# Altium schematic sheet POWER.SchDoc
size 420 x 297 mm; DocumentNumber: 4; SheetNumber: 4; SheetTotal: 17
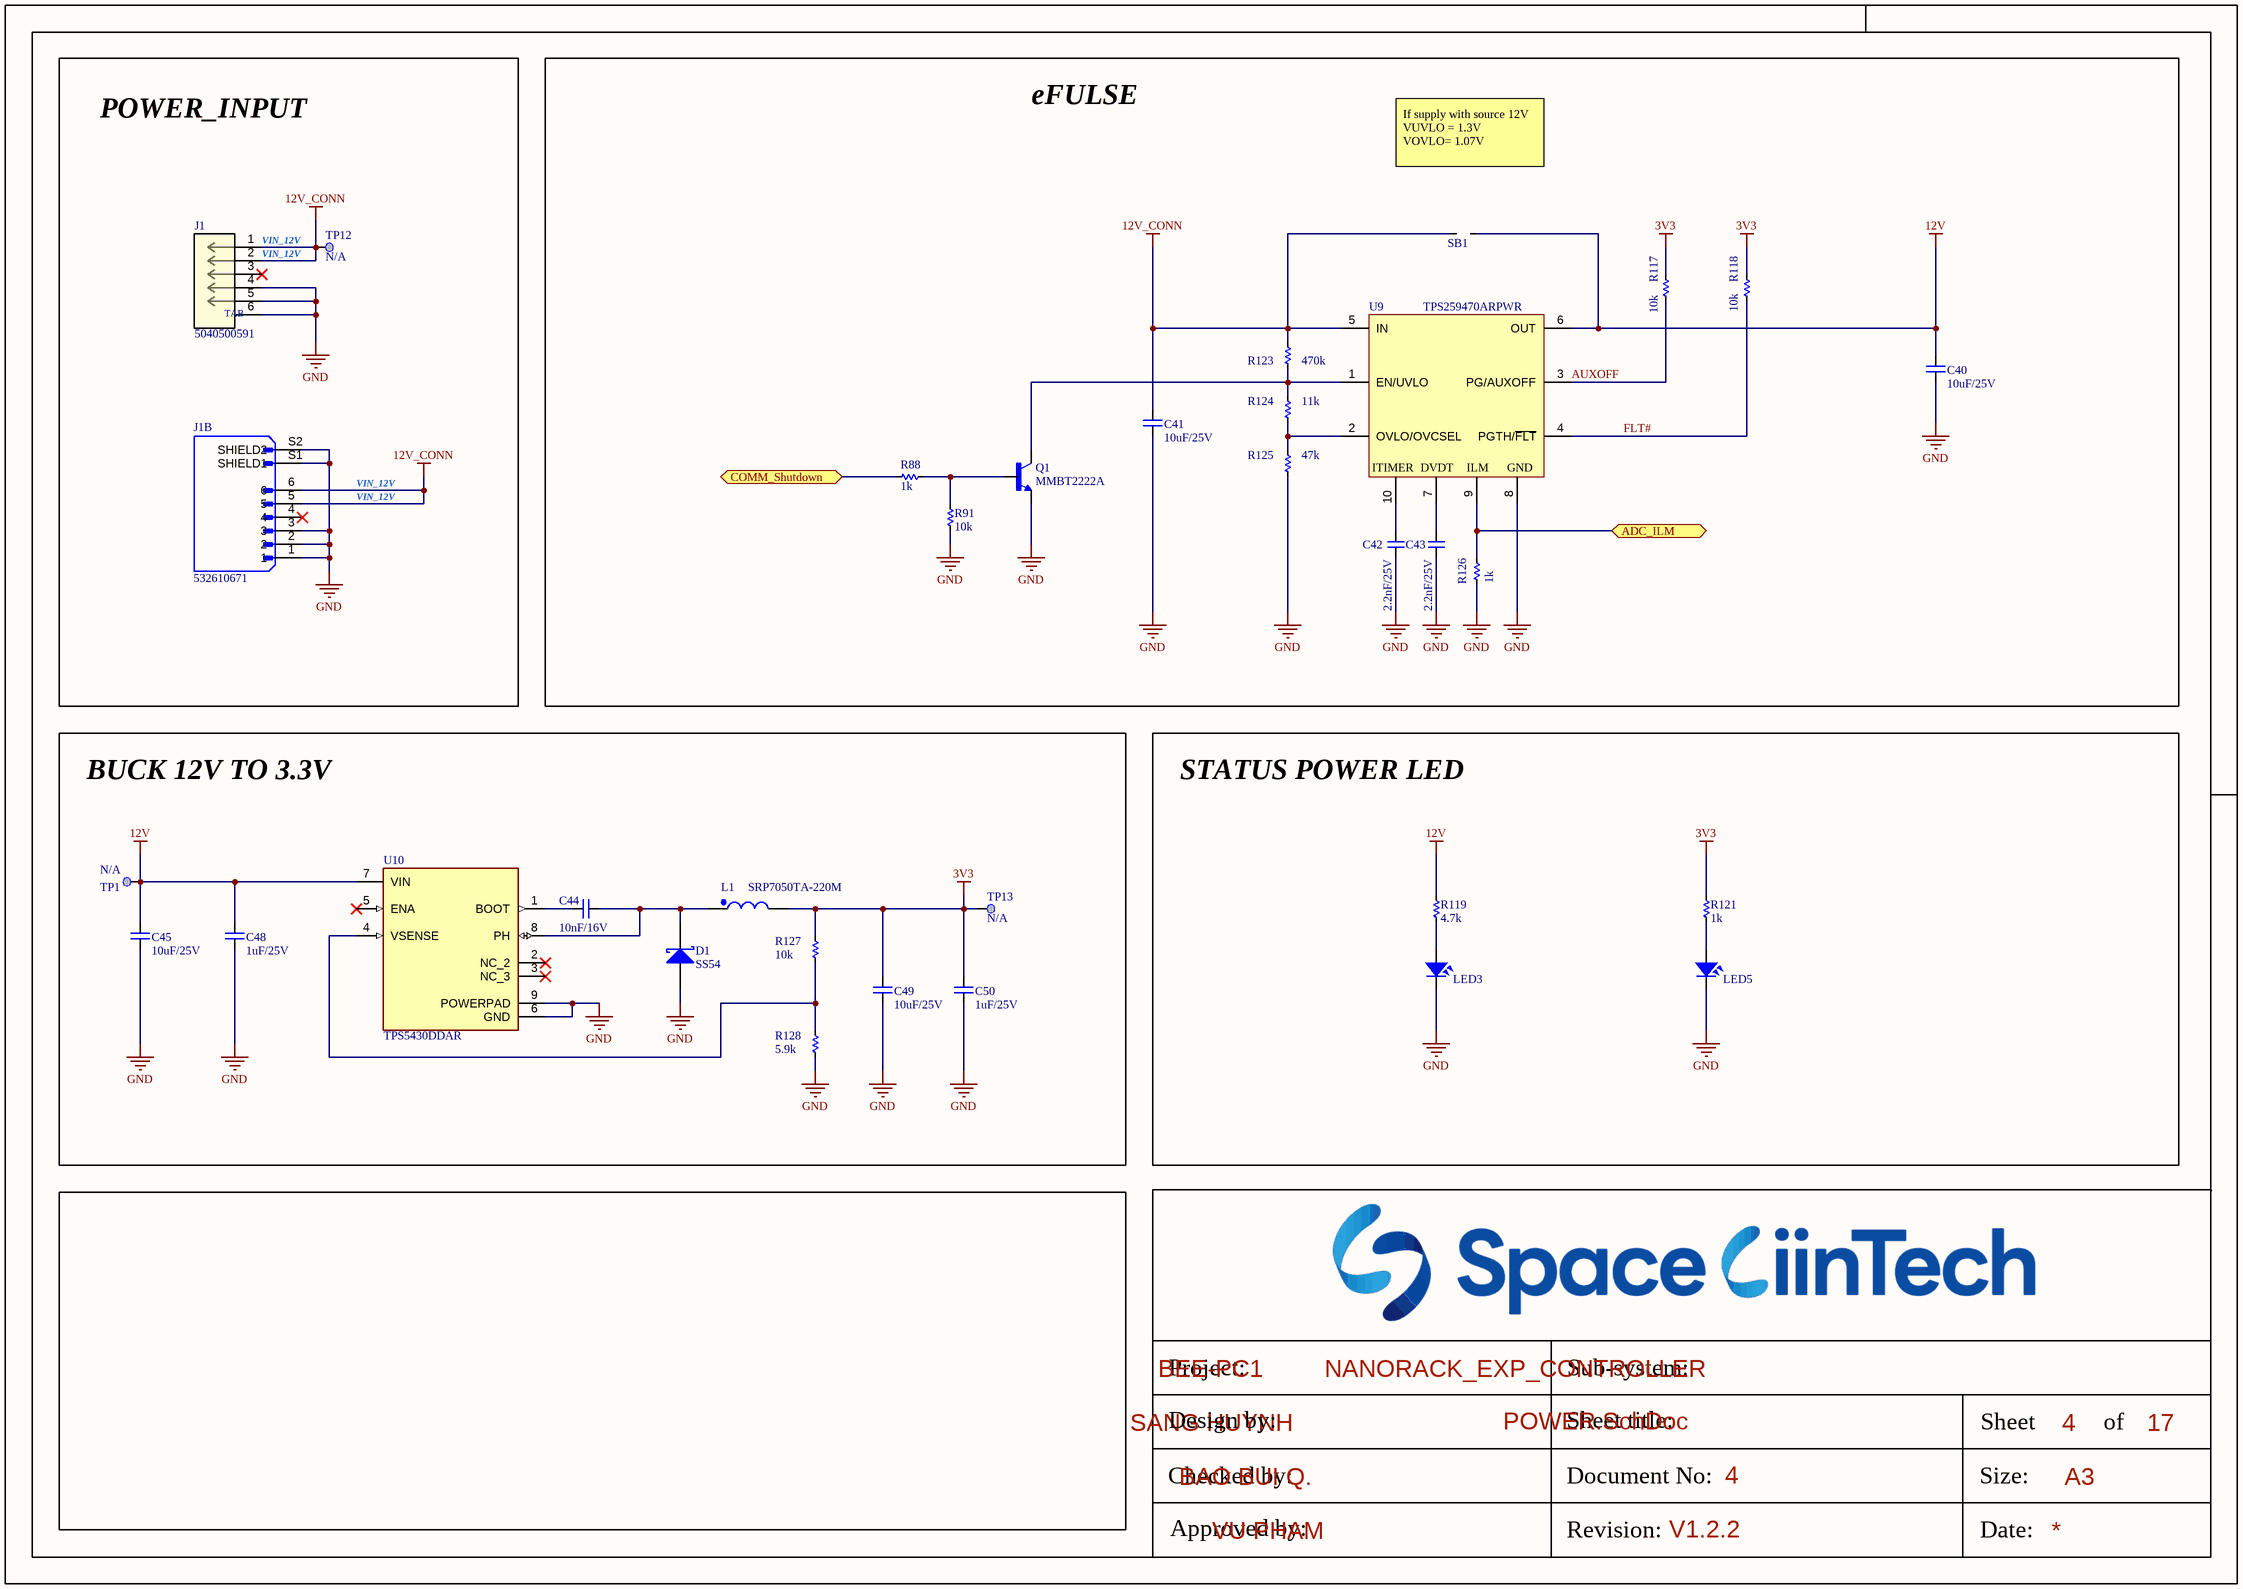
[diagram p0: POWER.SchDoc]

## Parts
C40  10uF/25V  [CAP_C_1608X80]
C41  10uF/25V  [CAP_C_1608X80]
C42  2.2nF/25V  [CAP_C_1608X80]
C43  2.2nF/25V  [CAP_C_1608X80]
C44  10nF/16V  [CAP_C_1608X80]
C45  10uF/25V  [CAP_C_1608X80]
C48  1uF/25V  [CAP_C_1608X80]
C49  10uF/25V  [CAP_C_1608X80]
C50  1uF/25V  [CAP_C_1608X80]
D1  SS54  [DO-214AC_SMA]
J1  5040500591  [5040500591]
J1B  532610671  [MOLEX_532610671]
L1  SRP7050TA-220M  [SRP7050TA-220M]
LED3  150060RS75000  [LED_0603]  (value not drawn)
LED5  150060YS75000  [LED_0603]  (value not drawn)
Q1  MMBT2222A  [SOT95P240X120-3N]
R88  1k  [RES_C_1608X60]
R91  10k  [RES_C_1608X60]
R117  10k  [RES_C_1608X60]
R118  10k  [RES_C_1608X60]
R119  4.7k  [RES_C_1608X60]
R121  1k  [RES_C_1608X60]
R123  470k  [RES_C_1608X60]
R124  11k  [RES_C_1608X60]
R125  47k  [RES_C_1608X60]
R126  1k  [RES_C_1608X60]
R127  10k  [RES_C_1608X60]
R128  5.9k  [RES_C_1608X60]
SB1  JUMPER  [JUMPER_1608]  (value not drawn)
TP1  Test Point  [TESTPOINT]  (value not drawn)  (no BOM)
TP12  Test Point  [TESTPOINT]  (value not drawn)  (no BOM)
TP13  Test Point  [TESTPOINT]  (value not drawn)  (no BOM)
U9  TPS259470ARPWR  [VQFN-HR-10]
U10  TPS5430DDAR  [CONV_TPS5430DDAR]

## Blocks framed on the sheet
POWER_INPUT: J1 J1B TP12
eFULSE: C40-C43 Q1 R88 R91 R117 R118 R123-R126 SB1 U9
BUCK 12V TO 3.3V: C44 C45 C48-C50 D1 L1 R127 R128 TP1 TP13 U10
STATUS POWER LED: LED3 LED5 R119 R121

## Ports
ADC_ILM (bidir), COMM_Shutdown (bidir)

## Nets
3V3: C49.2 C50.2 L1.2 R117.2 R118.2 R121.2 R127.1 TP13.1
12V: C40.2 C45.2 C48.2 R119.2 SB1.2 TP1.1 U9.6(OUT) U10.7(VIN)
12V_CONN: C41.2 J1.1 J1.2 J1B.5 J1B.6 R123.1 SB1.1 TP12.1 U9.5(IN)
GND: C40.1 C41.1 C42.1 C43.1 C45.1 C48.1 C49.1 C50.1 D1.1(A) J1.4 J1.5 J1.6 J1B.1 J1B.2 J1B.3 J1B.S1(SHIELD1) J1B.S2(SHIELD2) LED3.2 LED5.2 Q1.2(E) R91.1 R125.2 R126.2 R128.2 U9.8(GND) U10.6(GND) U10.9(POWERPAD)
ADC_ILM: R126.1 U9.9(ILM) ; port ADC_ILM
AUXOFF: R117.1 U9.3(PG/AUXOFF)
COMM_Shutdown: R88.1 ; port COMM_Shutdown
FLT#: R118.1 U9.4(PGTH/~{FLT})
NetC42_2: C42.2 U9.10(ITIMER)
NetC43_2: C43.2 U9.7(DVDT)
NetC44_1: C44.1 D1.2(K) L1.1 U10.8(PH)
NetC44_2: C44.2 U10.1(BOOT)
NetLED3_1: LED3.1 R119.1
NetLED5_1: LED5.1 R121.1
NetQ1_1: Q1.1(B) R88.2 R91.2
NetQ1_3: Q1.3(C) R123.2 R124.1 U9.1(EN/UVLO)
NetR124_2: R124.2 R125.1 U9.2(OVLO/OVCSEL)
NetR127_2: R127.2 R128.1 U10.4(VSENSE)

Not connected (* = marked no-connect by the designer): J1 3*; J1B 4*; U10 2(NC_2)* 3(NC_3)* 5(ENA)*

## Notes on the sheet
- If supply with source 12V
  VUVLO = 1.3V
  VOVLO= 1.07V
- VIN_12V
- Project:
- BEE-PC1
- Sub-system:
- NANORACK_EXP_CONTROLLER
- Design by:
- SANG HUYNH
- BAO BUI Q.
- Sheet title:
- Sheet
- A3
- of
- Checked by:
- Approved by:
- VU PHAM
- Revision:
- Document No:
- V1.2.2
- Size:
- Date:
- (in symbol 5040500591) TAB

## Library data of the parts
C40 C41 C44 C45 C48-C50 = CAP_SMD: CAP_Chip; Value: 33pF
C42 C43 = _CAP_C_2: CAP CHIP
D1 = SS54: DIODE SCHOTTKY 40V 5A SMA; MPN: SS34; Solder: SMT; Value: SS34; MFR: *
J1 = 5040500591: 1.50mm Pitch, Pico-Lock PCB Header, Single Row, Right-Angle, Surface Mount, Gold (Au) Plating, Positive Lock, 5 Circuits, Tape and Reel; Manufacturer_Name: Molex Connector Corporation; Copyright: Copyright (C) 2025 Ultra Librarian. All rights reserved.; Manufacturer_Part_Number: 5040500591; RefDes: RefDes; Type: Type
J1B = CONN_SMD_06: Value: *; Availability: Unavailable; Package: None; MP: 532610671; Price: None
L1 = _IND: FIXED IND 22UH 2.5A 170 MOHM SMD
LED3 LED5 = LED SMD: Value: LED 3 - 5 ly 2 Colour
Q1 = MMBT2222A: BJT, SOT-23, 40V, 600mA, NPN, 0.25W, 150Â°C; MF: Diotec Semiconductor; SnapEDA_Link: https://www.snapeda.com/parts/MMBT2222A/Diotec/view-part/?ref=snap; Package: SOT-23 Diotec; Value: *; MP: MMBT2222A; Check_prices: https://www.snapeda.com/parts/MMBT2222A/Diotec/view-part/?ref=eda
R88 R91 R117-R119 R121 R123-R128 = _RES_B_2: RES
TP1 TP12 TP13 = MCD-00630: Test Point 0.3mm; Part_Type: Misc; Part_Preference: Recommended; Initial_Board_Reference: MB1264; ID: 3115; ShowFields: YES; Component_Country_Of_Origin: Unknown; Internal_Part_Number: MCD-00630; Status: Released; ECCN_US: n/a; ECCN_EU: n/a; Provided_By: n/a; Manufacturer: N/A; Manufacturer_Part_Number: N/A; Order_Code_Digikey: N/A; Order_Code_Farnell: N/A; Order_Code_RS: N/A; Value: N/A; ComponentLink1URL: http://tunmcdsvn.tun.st.com/Component_Documentation_Library/Trunk; Manufacturer_HQ_COO: Unknown
U10 = TPS5430DDAR: 5.5V to 36V Input, 3A, 500kHz Step-Down Converter; MF: Texas Instruments; Package: HSOIC-8 Texas Instruments; Check_prices: https://www.snapeda.com/parts/TPS5430DDAR/Texas+Instruments/view-part/?ref=eda; Value: *; Purchase-URL: https://pricing.snapeda.com/search/part/TPS5430DDAR/?ref=eda; Availability: In Stock; SnapEDA_Link: https://www.snapeda.com/parts/TPS5430DDAR/Texas+Instruments/view-part/?ref=snap; MP: TPS5430DDAR; Price: None